# EasyEDA Pro project ProPrj_cheap-board_2026-05-07.epro, board PCB1
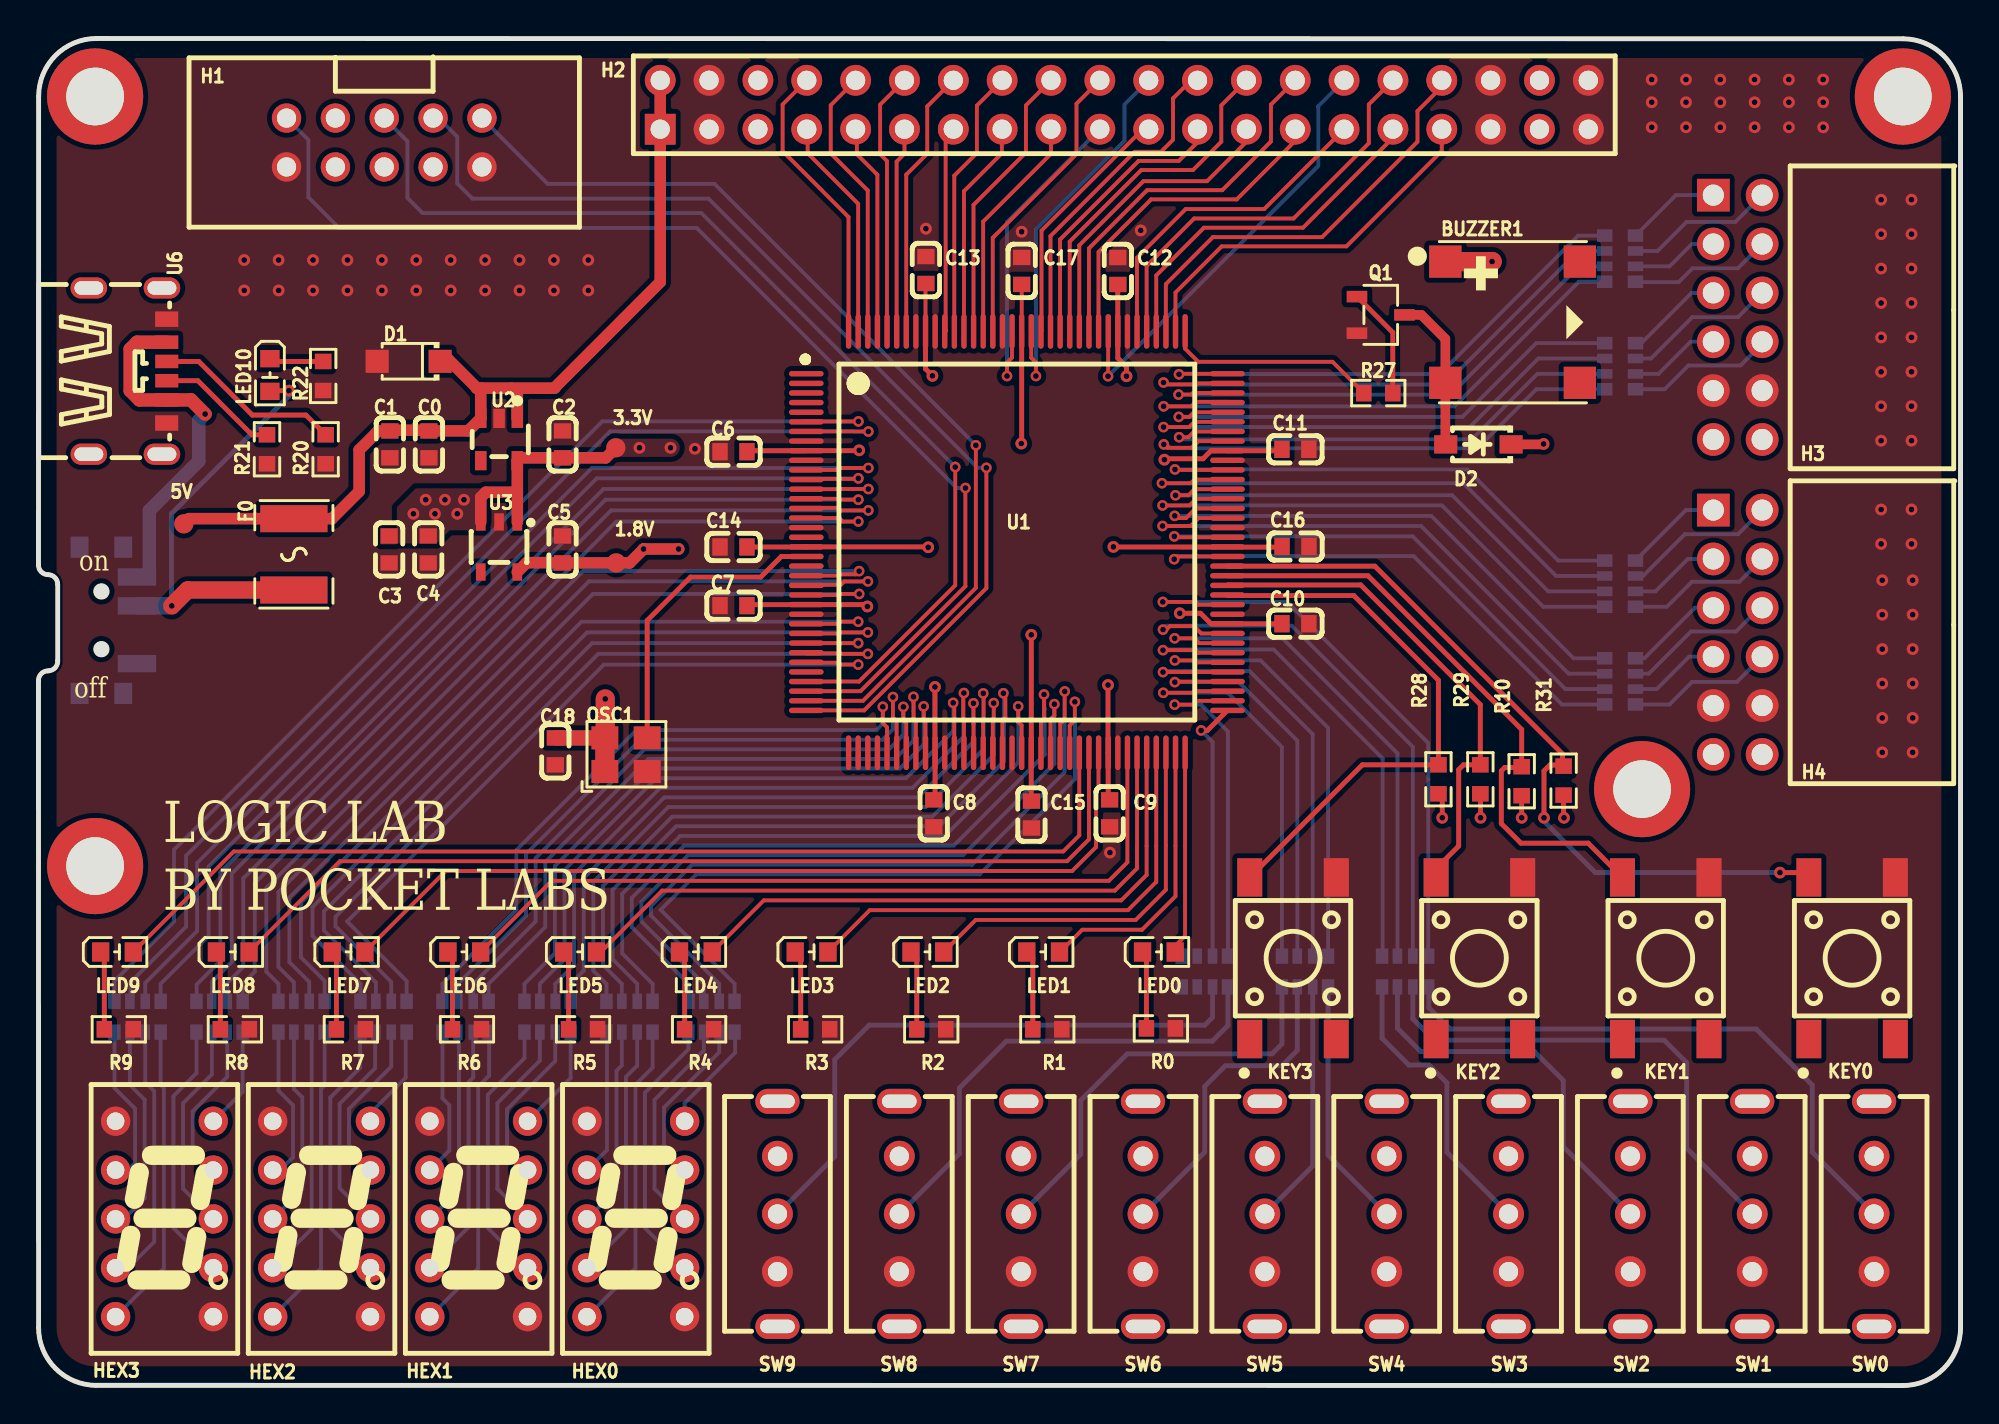
[diagram p1: board, top side]
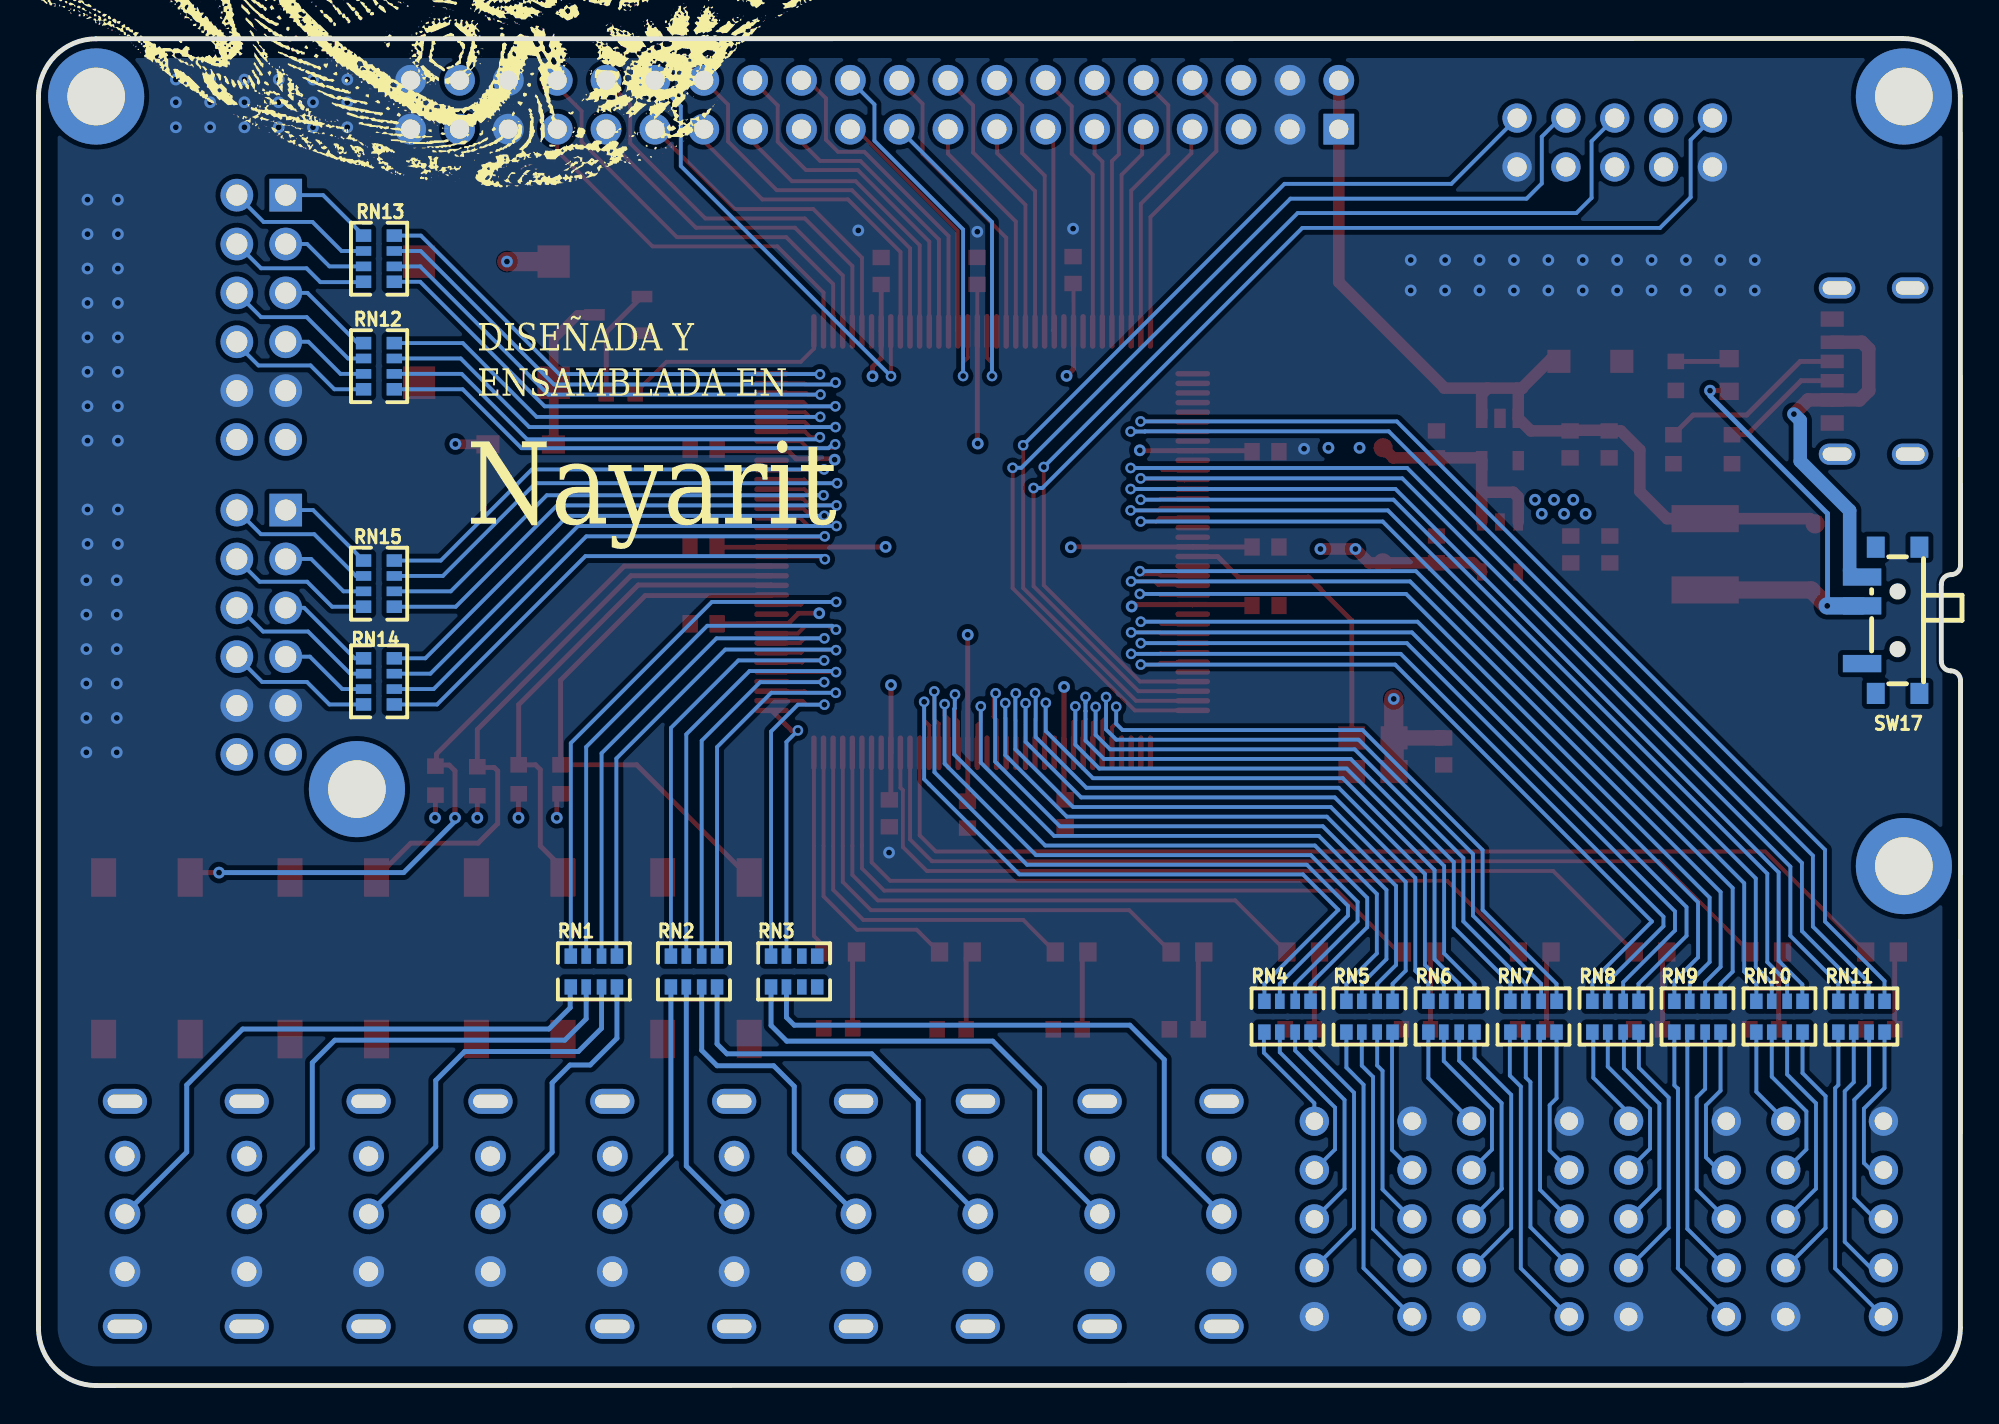
[diagram p2: board, bottom side, seen from below]

Outline 99.95 x 70.02 mm; copper layers: Top Layer, Inner1, Inner2, Bottom Layer. Coordinates in mm from the lower left corner of the outline.
Outline path: 0,36.65 arc(0.15,37) 0.5,37.15 arc(0.85,37.29) 1,37.65 1,41.65 arc(0.85,42) 0.5,42.15 arc(0.15,42.29) 0,42.65 0.01,67.01 arc(0.89,69.14) 3.02,70.02 96.95,70 arc(99.07,69.12) 99.95,67 99.95,3 arc(99.07,0.88) 96.95,0 3.01,0.01 arc(0.88,0.89) 0.01,3.01 0,36.65
Stack: Top Layer 0.035mm Outer layer thickness 1oz / Dielectric1 0.2104mm 7628 RC49% 8.6mil / Inner1 0.0152mm Inner layer thickness / Dielectric2 1.065mm 1.1mm H/HOZ Copper / Inner2 0.0152mm Inner layer thickness / Dielectric3 0.2104mm 7628 RC49% 8.6mil / Bottom Layer 0.035mm Outer layer thickness 1oz

## Design rules (mm)
template: Custom Config
spacing copperThickness1oz (default): track to track 0.102, other pairs 0.152 to 0.3
spacing copperThickness2oz: track to track 0.203, other pairs 0.152 to 0.3
track width copperThickness1oz (default): min 0.127, default 0.254, max 2.54
track width copperThickness2oz: min 0.203, default 0.254, max 2.54
differential pair differentialPair (default): width min 0.127, default 0.254, max 2.54; gap min 0.152, default 0.152
via viaSize (default): diameter min 0.5, default 0.61, max 10; hole min 0.3, default 0.305, max 6.3

## Placement (name value [footprint] x y rotation side)
1.8V  -  [Test-Point-0.5mm]  30.04 42.76 0 top
3.3V  -  [Test-Point-0.5mm]  30.02 48.74 0 top
5V  -  [Test-Point-0.5mm]  7.56 44.79 0 top
BUZZER1  2.7kHz  [BUZ-SMD_4P-L7.5-W7.5-P7.59-TL]  76.65 55.27 0 top
C0  100nF  [C0603]  20.3 48.92 90 top
C1  4.7uF  [C0603]  18.27 48.92 90 top
C2  4.7uF  [C0603]  27.25 48.92 270 top
C3  100nF  [C0603]  18.23 43.46 90 top
C4  4.7uF  [C0603]  20.27 43.46 90 top
C5  4.7uF  [C0603]  27.25 43.46 270 top
C6  100nF  [C0603]  36.14 48.54 0 top
C7  100nF  [C0603]  36.14 40.54 0 top
C8  100nF  [C0603]  46.56 29.74 90 top
C9  100nF  [C0603]  55.7 29.74 90 top
C10  100nF  [C0603]  65.36 39.6 180 top
C11  100nF  [C0603]  65.36 48.66 180 top
C12  100nF  [C0603]  56.13 57.93 270 top
C13  100nF  [C0603]  46.15 57.98 270 top
C14  100nF  [C0603]  36.14 43.58 0 top
C15  100nF  [C0603]  51.63 29.68 90 top
C16  100nF  [C0603]  65.37 43.61 180 top
C17  100nF  [C0603]  51.13 57.94 270 top
C18  100nF  [C0603]  26.88 32.96 90 top
D1  SMF5.0A  [SOD-123FL_L2.7-W1.8-LS3.8-RD]  19.25 53.24 180 top
D2  1N4148W-7-F  [SOD-123_L2.7-W1.6-LS3.7-RD-1]  74.88 48.92 180 top
F0  MF-MSMF050-2  [F1812]  13.28 43.2 270 top
H1  2.54-2*5P简牛  [IDC-TH_10P-P2.54_C5665]  17.98 64.61 180 top
H2  2.54-2*20  [HDR-TH_40P-P2.54-V-F-R2-C20-S2.54]  56.46 66.57 0 top
H3  HX PM2.54-2x6P WC  [HDR-TH_12P-P2.54-H-F-R2-C6-S2.54-W12.7-N]  88.36 55.52 90 top
H4  HX PM2.54-2x6P WC  [HDR-TH_12P-P2.54-H-F-R2-C6-S2.54-W12.7-N]  88.36 39.15 90 top
HEX0  FJ3161AH  [LED-SEG-TH_10P-L14.0-W7.5-P2.54-S5.08-TL]  31.06 8.66 0 top
HEX1  FJ3161AH  [LED-SEG-TH_10P-L14.0-W7.5-P2.54-S5.08-TL]  22.89 8.66 0 top
HEX2  FJ3161AH  [LED-SEG-TH_10P-L14.0-W7.5-P2.54-S5.08-TL]  14.72 8.66 0 top
HEX3  FJ3161AH  [LED-SEG-TH_10P-L14.0-W7.5-P2.54-S5.08-TL]  6.55 8.66 0 top
KEY0  KH-6X6X6H-STM  [SW-SMD_4P-L6.0-W6.0-P4.50-LS9.0_KH-6X6X6H-STM]  94.31 22.21 90 top
KEY1  KH-6X6X6H-STM  [SW-SMD_4P-L6.0-W6.0-P4.50-LS9.0_KH-6X6X6H-STM]  84.62 22.21 90 top
KEY2  KH-6X6X6H-STM  [SW-SMD_4P-L6.0-W6.0-P4.50-LS9.0_KH-6X6X6H-STM]  74.93 22.21 90 top
KEY3  KH-6X6X6H-STM  [SW-SMD_4P-L6.0-W6.0-P4.50-LS9.0_KH-6X6X6H-STM]  65.24 22.21 90 top
LED0  YLED0603R  [LED0603-FD]  58.26 22.53 180 top
LED1  YLED0603R  [LED0603-FD]  52.24 22.53 180 top
LED2  YLED0603R  [LED0603-FD]  46.22 22.53 180 top
LED3  YLED0603R  [LED0603-FD]  40.2 22.53 180 top
LED4  YLED0603R  [LED0603-FD]  34.18 22.53 180 top
LED5  YLED0603R  [LED0603-FD]  28.16 22.53 180 top
LED6  YLED0603R  [LED0603-FD]  22.14 22.53 180 top
LED7  YLED0603R  [LED0603-FD]  16.12 22.53 180 top
LED8  YLED0603R  [LED0603-FD]  10.1 22.53 180 top
LED9  YLED0603R  [LED0603-FD]  4.08 22.53 180 top
LED10  YLED0603R  [LED0603-FD]  12.03 52.52 90 top
NOREF  -  [Pad_e107]  96.95 67 0 top
NOREF#2  -  [Pad_e109]  2.95 27 0 top
NOREF#3  -  [Pad_e110]  83.39 31 0 top
NOREF#4  -  [Pad_e106]  2.95 67 0 top
OSC1  50MHz  [OSC-SMD_4P-L3.2-W2.5-BL]  30.55 32.79 0 top
Q1  MMBT3904LT1G  [SOT-23-3_L2.9-W1.6-P1.90-LS2.8-BR]  69.8 55.65 180 top
R0  1kΩ  [R0603]  58.37 18.56 180 top
R1  1kΩ  [R0603]  52.46 18.52 180 top
R2  1kΩ  [R0603]  46.42 18.52 180 top
R3  1kΩ  [R0603]  40.39 18.52 180 top
R4  1kΩ  [R0603]  34.35 18.52 180 top
R5  1kΩ  [R0603]  28.32 18.52 180 top
R6  1kΩ  [R0603]  22.28 18.52 180 top
R7  1kΩ  [R0603]  16.25 18.52 180 top
R8  1kΩ  [R0603]  10.21 18.52 180 top
R9  1kΩ  [R0603]  4.18 18.52 180 top
R10  0kΩ  [R0603]  77.13 31.41 270 top
R20  5.1kΩ  [R0603]  14.93 48.66 90 top
R21  5.1kΩ  [R0603]  11.88 48.66 90 top
R22  10kΩ  [R0603]  14.8 52.47 90 top
R27  1kΩ  [R0603]  69.67 51.58 180 top
R28  0kΩ  [R0603]  72.8 31.51 270 top
R29  0kΩ  [R0603]  74.98 31.51 270 top
R31  0kΩ  [R0603]  79.31 31.44 270 top
RN1  10kΩ  [RES-ARRAY-SMD_0603-8P-L3.2-W1.6-BL]  71.07 21.52 180 bottom
RN2  10kΩ  [RES-ARRAY-SMD_0603-8P-L3.2-W1.6-BL]  65.86 21.52 180 bottom
RN3  10kΩ  [RES-ARRAY-SMD_0603-8P-L3.2-W1.6-BL]  60.65 21.52 180 bottom
RN4  1kΩ  [RES-ARRAY-SMD_0603-8P-L3.2-W1.6-BL]  35 19.17 180 bottom
RN5  1kΩ  [RES-ARRAY-SMD_0603-8P-L3.2-W1.6-BL]  30.73 19.17 180 bottom
RN6  1kΩ  [RES-ARRAY-SMD_0603-8P-L3.2-W1.6-BL]  26.47 19.17 180 bottom
RN7  1kΩ  [RES-ARRAY-SMD_0603-8P-L3.2-W1.6-BL]  22.21 19.17 180 bottom
RN8  1kΩ  [RES-ARRAY-SMD_0603-8P-L3.2-W1.6-BL]  17.94 19.17 180 bottom
RN9  1kΩ  [RES-ARRAY-SMD_0603-8P-L3.2-W1.6-BL]  13.68 19.17 180 bottom
RN10  1kΩ  [RES-ARRAY-SMD_0603-8P-L3.2-W1.6-BL]  9.42 19.17 180 bottom
RN11  1kΩ  [RES-ARRAY-SMD_0603-8P-L3.2-W1.6-BL]  5.15 19.17 180 bottom
RN12  100Ω  [RES-ARRAY-SMD_0603-8P-L3.2-W1.6-BL]  82.24 52.98 270 bottom
RN13  100Ω  [RES-ARRAY-SMD_0603-8P-L3.2-W1.6-BL]  82.24 58.57 270 bottom
RN14  100Ω  [RES-ARRAY-SMD_0603-8P-L3.2-W1.6-BL]  82.24 36.6 270 bottom
RN15  100Ω  [RES-ARRAY-SMD_0603-8P-L3.2-W1.6-BL]  82.24 41.68 270 bottom
SW0  SS12F44G4  [SW-TH_SHOU-HAN_SS12F44G4]  95.45 8.92 90 top
SW1  SS12F44G4  [SW-TH_SHOU-HAN_SS12F44G4]  89.11 8.92 90 top
SW2  SS12F44G4  [SW-TH_SHOU-HAN_SS12F44G4]  82.78 8.92 90 top
SW3  SS12F44G4  [SW-TH_SHOU-HAN_SS12F44G4]  76.44 8.92 90 top
SW4  SS12F44G4  [SW-TH_SHOU-HAN_SS12F44G4]  70.11 8.92 90 top
SW5  SS12F44G4  [SW-TH_SHOU-HAN_SS12F44G4]  63.77 8.92 90 top
SW6  SS12F44G4  [SW-TH_SHOU-HAN_SS12F44G4]  57.43 8.92 90 top
SW7  SS12F44G4  [SW-TH_SHOU-HAN_SS12F44G4]  51.1 8.92 90 top
SW8  SS12F44G4  [SW-TH_SHOU-HAN_SS12F44G4]  44.76 8.92 90 top
SW9  SS12F44G4  [SW-TH_SHOU-HAN_SS12F44G4]  38.43 8.92 90 top
SW17  MK-12C02-G020  [SW-SMD_MK-12C02-G020]  3.63 39.77 90 bottom
U1  5M240ZT144C5N  [TQFP-144_L20.0-W20.0-P0.50-LS22.0-BL]  50.88 43.84 270 top
U2  AP2112K-3.3TRG1  [SOT-23-5_L2.9-W1.6-P0.95-LS2.8-BR]  23.95 49.17 90 top
U3  AP2112K-1.8TRG1  [SOT-25_L3.0-W1.6-P0.95-LS2.8-BL]  23.95 43.58 180 top
U6  USB-TYPE-C-009  [TYPE-C-SMD_TYPE-C-6P]  4.64 52.73 270 top

## Footprints (pads in the part's own frame, mm; a bottom-side part is the same pattern mirrored in y, then rotated)
BUZ-SMD_4P-L7.5-W7.5-P7.59-TL
  rect 1.681x1.68 smd: 1(-3.498,3.15) 2(-3.498,-3.15) 3(3.498,-3.15) 4(3.498,3.15)
C0603
  rect 0.8x0.9 smd: 1(-0.7,0) 2(0.7,0)
F1812
  rect 1.407x3.499 smd: 1(-1.853,0) 2(1.853,0)
HDR-TH_12P-P2.54-H-F-R2-C6-S2.54-W12.7-N
  rect 1.7x1.7 hole 1.1: 1(6.35,1.27)
  round 1.7 hole 1.1: 2(6.35,-1.27) 3(3.81,1.27) 4(3.81,-1.27) 5(1.27,1.27) 6(1.27,-1.27) 7(-1.27,1.27) 8(-1.27,-1.27) 9(-3.81,1.27) 10(-3.81,-1.27) 11(-6.35,1.27) 12(-6.35,-1.27)
HDR-TH_40P-P2.54-V-F-R2-C20-S2.54
  rect 1.6x1.6 hole 1: 1(-24.13,-1.27)
  round 1.6 hole 1: 2(-24.13,1.27) 3(-21.59,-1.27) 4(-21.59,1.27) 5(-19.05,-1.27) 6(-19.05,1.27) 7(-16.51,-1.27) 8(-16.51,1.27) 9(-13.97,-1.27) 10(-13.97,1.27) 11(-11.43,-1.27) 12(-11.43,1.27) 13(-8.89,-1.27) 14(-8.89,1.27) 15(-6.35,-1.27) 16(-6.35,1.27) 17(-3.81,-1.27) 18(-3.81,1.27) 19(-1.27,-1.27) 20(-1.27,1.27) 21(1.27,-1.27) 22(1.27,1.27) 23(3.81,-1.27) 24(3.81,1.27) 25(6.35,-1.27) 26(6.35,1.27) 27(8.89,-1.27) 28(8.89,1.27) 29(11.43,-1.27) 30(11.43,1.27) 31(13.97,-1.27) 32(13.97,1.27) 33(16.51,-1.27) 34(16.51,1.27) 35(19.05,-1.27) 36(19.05,1.27) 37(21.59,-1.27) 38(21.59,1.27) 39(24.13,-1.27) 40(24.13,1.27)
IDC-TH_10P-P2.54_C5665
  round 1.524 hole 1: 1(-5.08,-1.27) 2(-5.08,1.27) 3(-2.54,-1.27) 4(-2.54,1.27) 5(0,-1.27) 6(0,1.27) 7(2.54,-1.27) 8(2.54,1.27) 9(5.08,-1.27) 10(5.08,1.27)
LED0603-FD
  rect 0.9x1 smd: 1(-0.85,0) 2(0.85,0)
LED-SEG-TH_10P-L14.0-W7.5-P2.54-S5.08-TL
  round 1.524 hole 0.914: 1(-2.54,5.08) 2(-2.54,2.54) 3(-2.54,0) 4(-2.54,-2.54) 5(-2.54,-5.08) 6(2.54,-5.08) 7(2.54,-2.54) 8(2.54,0) 9(2.54,2.54) 10(2.54,5.08)
OSC-SMD_4P-L3.2-W2.5-BL
  rect 1.4x1.2 smd: 1(-1.1,-0.875) 2(1.1,-0.875) 3(1.1,0.875) 4(-1.1,0.875)
Pad_e106
  round 5 hole 3: 1(0,0)
Pad_e107
  round 5 hole 3: 1(0,0)
Pad_e109
  round 5 hole 3: 1(0,0)
Pad_e110
  round 5 hole 3: 1(0,0)
R0603
  rect 0.806x0.864 smd: 1(-0.753,0) 2(0.753,0)
RES-ARRAY-SMD_0603-8P-L3.2-W1.6-BL
  rect 0.65x0.8 smd: 1(-1.2,-0.8) 4(1.2,-0.8) 5(1.2,0.8) 8(-1.2,0.8)
  rect 0.5x0.8 smd: 2(-0.4,-0.8) 3(0.4,-0.8) 6(0.4,0.8) 7(-0.4,0.8)
SOD-123_L2.7-W1.6-LS3.7-RD-1
  rect 1.2x0.95 smd: 1(-1.7,0) 2(1.7,0)
SOD-123FL_L2.7-W1.8-LS3.8-RD
  rect 1.2x1.2 smd: 1(-1.635,0) 2(1.635,0)
SOT-23-3_L2.9-W1.6-P1.90-LS2.8-BR
  rect 1.07x0.6 smd: 1(1.235,-0.95) 2(1.235,0.95) 3(-1.235,0)
SOT-23-5_L2.9-W1.6-P0.95-LS2.8-BR
  rect 1x0.6 smd: 1(1.1,-0.95) 2(1.1,0) 3(1.1,0.95) 4(-1.1,0.95) 5(-1.1,-0.95)
SOT-25_L3.0-W1.6-P0.95-LS2.8-BL
  rect 0.5x0.9 smd: 1(-0.95,-1.3) 2(0,-1.3) 3(0.95,-1.3) 4(0.95,1.3) 5(-0.95,1.3)
SW-SMD_4P-L6.0-W6.0-P4.50-LS9.0_KH-6X6X6H-STM
  rect 2x1.3 smd: 1(-4.2,2.25) 2(4.2,2.25) 3(-4.2,-2.25) 4(4.2,-2.25)
SW-SMD_MK-12C02-G020
  rect 0.9x2 smd: 1(-2.25,1.49) 2(0.75,1.49) 3(2.25,1.49)
  rect 1.1x0.93 smd: 4(3.8,0.779) 5(3.8,-1.49) 6(-3.8,-1.49) 7(-3.8,0.779)
SW-TH_SHOU-HAN_SS12F44G4
  round 1.6 hole 1: 1(-3,0) 2(0,0) 3(3,0)
  oval 1.3x2.3 hole 0.7x1.8: 4(5.85,0) 5(-5.85,0)
Test-Point-0.5mm
  round 1 smd: 1(0,0)
TQFP-144_L20.0-W20.0-P0.50-LS22.0-BL
  oval 0.28x1.8 smd: 1(-8.75,-10.95) 2(-8.25,-10.95) 3(-7.75,-10.95) 4(-7.25,-10.95) 5(-6.75,-10.95) 6(-6.25,-10.95) 7(-5.75,-10.95) 8(-5.25,-10.95) 9(-4.75,-10.95) 10(-4.25,-10.95) 11(-3.75,-10.95) 12(-3.25,-10.95) 13(-2.75,-10.95) 14(-2.25,-10.95) 15(-1.75,-10.95) 16(-1.25,-10.95) 17(-0.75,-10.95) 18(-0.25,-10.95) 19(0.25,-10.95) 20(0.75,-10.95) 21(1.25,-10.95) 22(1.75,-10.95) 23(2.25,-10.95) 24(2.75,-10.95) 25(3.25,-10.95) 26(3.75,-10.95) 27(4.25,-10.95) 28(4.75,-10.95) 29(5.25,-10.95) 30(5.75,-10.95) 31(6.25,-10.95) 32(6.75,-10.95) 33(7.25,-10.95) 34(7.75,-10.95) 35(8.25,-10.95) 36(8.75,-10.95) 73(8.75,10.95) 74(8.25,10.95) 75(7.75,10.95) 76(7.25,10.95) 77(6.75,10.95) 78(6.25,10.95) 79(5.75,10.95) 80(5.25,10.95) 81(4.75,10.95) 82(4.25,10.95) 83(3.75,10.95) 84(3.25,10.95) 85(2.75,10.95) 86(2.25,10.95) 87(1.75,10.95) 88(1.25,10.95) 89(0.75,10.95) 90(0.25,10.95) 91(-0.25,10.95) 92(-0.75,10.95) 93(-1.25,10.95) 94(-1.75,10.95) 95(-2.25,10.95) 96(-2.75,10.95) 97(-3.25,10.95) 98(-3.75,10.95) 99(-4.25,10.95) 100(-4.75,10.95) 101(-5.25,10.95) 102(-5.75,10.95) 103(-6.25,10.95) 104(-6.75,10.95) 105(-7.25,10.95) 106(-7.75,10.95) 107(-8.25,10.95) 108(-8.75,10.95)
  oval 1.8x0.28 smd: 37(10.95,-8.75) 38(10.95,-8.25) 39(10.95,-7.75) 40(10.95,-7.25) 41(10.95,-6.75) 42(10.95,-6.25) 43(10.95,-5.75) 44(10.95,-5.25) 45(10.95,-4.75) 46(10.95,-4.25) 47(10.95,-3.75) 48(10.95,-3.25) 49(10.95,-2.75) 50(10.95,-2.25) 51(10.95,-1.75) 52(10.95,-1.25) 53(10.95,-0.75) 54(10.95,-0.25) 55(10.95,0.25) 56(10.95,0.75) 57(10.95,1.25) 58(10.95,1.75) 59(10.95,2.25) 60(10.95,2.75) 61(10.95,3.25) 62(10.95,3.75) 63(10.95,4.25) 64(10.95,4.75) 65(10.95,5.25) 66(10.95,5.75) 67(10.95,6.25) 68(10.95,6.75) 69(10.95,7.25) 70(10.95,7.75) 71(10.95,8.25) 72(10.95,8.75) 109(-10.95,8.75) 110(-10.95,8.25) 111(-10.95,7.75) 112(-10.95,7.25) 113(-10.95,6.75) 114(-10.95,6.25) 115(-10.95,5.75) 116(-10.95,5.25) 117(-10.95,4.75) 118(-10.95,4.25) 119(-10.95,3.75) 120(-10.95,3.25) 121(-10.95,2.75) 122(-10.95,2.25) 123(-10.95,1.75) 124(-10.95,1.25) 125(-10.95,0.75) 126(-10.95,0.25) 127(-10.95,-0.25) 128(-10.95,-0.75) 129(-10.95,-1.25) 130(-10.95,-1.75) 131(-10.95,-2.25) 132(-10.95,-2.75) 133(-10.95,-3.25) 134(-10.95,-3.75) 135(-10.95,-4.25) 136(-10.95,-4.75) 137(-10.95,-5.25) 138(-10.95,-5.75) 139(-10.95,-6.25) 140(-10.95,-6.75) 141(-10.95,-7.25) 142(-10.95,-7.75) 143(-10.95,-8.25) 144(-10.95,-8.75)
TYPE-C-SMD_TYPE-C-6P
  oval 1.1x1.9 hole 0.7x1.5: 7(-4.32,1.775) 7(-4.32,-2.025) 7(4.32,1.775) 7(4.32,-2.025)
  rect 0.7x1.2 smd: A5(-0.5,2.025) A9(1.5,2.025) B5(0.5,2.025) B9(-1.5,2.025)
  rect 0.8x1.2 smd: A12(2.7,2.025) B12(-2.7,2.025)

## Nets
As in the schematic.

Pads without a net: BUZZER1 3 4; H1 6 7 8; KEY0 1 3; KEY1 1 3; KEY2 1 3; KEY3 1 3; NOREF 1; NOREF#2 1; NOREF#3 1; NOREF#4 1; RN3 3 4 5 6; SW0 4 5; SW1 4 5; SW2 4 5; SW3 4 5; SW4 4 5; SW5 4 5; SW6 4 5; SW7 4 5; SW8 4 5; SW9 4 5; SW17 1 4 5 6 7; U1 1 2 3 4 5 18 21 32 37 38 39 40; U2 4; U3 4; U6 7

## Via types
v1: diameter 0.61, hole 0.305, Top Layer to Bottom Layer, 111 vias
v2: diameter 0.55, hole 0.305, Top Layer to Bottom Layer, 65 vias

## Routing (per net, layer and track width the routed paths; a pad name or vN(x,y) marks a point on that pad's centre or on a via; arc(x,y) is an arc through that point)
1.8V: length 44.1
  Top Layer w0.2: 51.13,54.79 C17.2
  Top Layer w0.254: v1(46.27,43.57) 46.25,43.59 U1.19 ; v1(51.11,48.96) 51.13,48.98 U1.126 51.12,54.79 ; 51.62,32.89 51.62,30.39 C15.2 ; v1(55.9,43.59) 55.98,43.59 55.98,43.58 64.64,43.58 64.67,43.55 64.67,43.49 ; 36.84,43.58 39.92,43.58 39.92,43.59 ; 51.63,32.94 v1(51.63,39.02)
  Top Layer w0.6: U3.5 25.38,42.77 27.24,42.77 C5.2 30.04,42.76 ; 1.8V.1 30.74,42.76 v1(31.47,43.48) v1(33.29,43.48)
3.3V: length 73.3
  Top Layer w0.2: 46.05,57.23 46.12,57.16 U1.136
  Top Layer w0.254: R29.2 74.99,30.75 74.99,29.49 ; 46.63,32.94 46.62,32.95 v1(46.62,36.31) ; v1(43.1,40.49) 43,40.59 U1.25 ; v1(59.35,40.14) 60.42,40.14 60.97,39.59 U1.82 64.65,39.59 64.66,39.6 ; 55.62,32.89 55.62,30.45 55.7,30.38 ; 36.84,48.54 36.89,48.59 39.92,48.59 ; 46.62,32.89 46.62,30.44 46.68,30.38 ; U1.64 55.62,32.9 v1(55.62,36.41) ; R10.2 77.13,29.49 ; R31.2 79.31,29.58 79.33,29.56 ; U1.136 46.13,52.84 v1(46.49,52.48) ; v1(58.55,48.12) 58.59,48.17 60.55,48.17 60.97,48.59 U1.100 ; 64.68,48.47 64.57,48.59 61.83,48.59 ; v1(42.68,48.61) 42.66,48.59 U1.9 ; R28.2 73,30.56 73,29.46 ; v1(56.58,52.46) 56.58,52.95 56.13,53.4 U1.116 56.12,57.19 56.08,57.23 ; 36.84,40.66 36.92,40.59 39.92,40.59
  Top Layer w0.5: v1(78.27,48.94) 78.24,48.92 D2.1
  Top Layer w0.6: 3.3V.1 29.5,48.22 C2.2 25.05,48.22 U2.5 24.9,46.43 ; U3.3 23,46.17 23.26,46.43 24.9,46.43 ; 24.9,46.43 24.9,46.44 ; 24.9,46.43 U3.1
  Top Layer w0.8: 26.92,33.66 29.36,33.66 29.41,33.62
  Top Layer w1: OSC1.1 OSC1.4 29.41,33.62 ; v1(75.59,58.42) 75.58,58.42 BUZZER1.1 ; 29.47,33.68 v1(29.47,35.69)
  vias: v1(19.5,45.31) v1(20.14,46.04) v1(20.62,45.31) v1(21.14,46.04) v1(21.78,45.31) v1(22.13,46.04) v1(31.25,48.74) v1(32.87,48.74) v1(73,29.51) v1(74.99,29.51) v1(77.13,29.51) v1(79.33,29.51)
5VF: length 47.4
  Top Layer w0.6: 22.81,51.84 21.31,53.34 20.99,53.34 D1.1 ; 22.81,51.84 22.77,51.84 ; 22.81,51.84 22.87,51.77 23,51.77 ; 22.81,51.84 23.07,51.84 ; 26.86,51.88 32.33,57.36 H2.1 H2.2 ; 23,51.77 U2.3 22.34,49.62 C0.2 20.27,49.65 18.31,49.65 C1.2 17.66,49.62 16.68,48.63 16.68,46.47 15.26,45.06 F0.1 7.83,45.06 5V.1 ; 23,51.77 23.07,51.84 ; 23.07,51.84 24.58,51.84 ; 26.86,51.84 24.58,51.84 ; 24.58,51.84 24.9,51.52 U2.1
+5V: length 23.2
  Top Layer w0.254: v1(13.03,51.71) 12.07,51.71 LED10.1
  Top Layer w0.9: v1(6.93,40.52) 7.76,41.35 F0.2
  Bottom Layer w0.254: v1(6.93,40.52) 6.92,40.54 6.92,45.32 13.03,51.43 v1(13.03,51.71)
  Bottom Layer w0.9: SW17.2 v1(6.93,40.52)
GND:
  vias: v1(10.7,58.5) v1(10.7,56.92) v1(12.49,58.5) v1(12.49,56.92) v1(14.28,58.5) v1(14.28,56.92) v1(16.07,58.5) v1(16.07,56.92) v1(17.86,58.5) v1(17.86,56.92) v1(19.64,58.5) v1(19.65,56.92) v1(21.43,58.5) v1(21.44,56.92) v1(23.22,58.5) v1(23.22,56.92) v1(25.01,58.5) v1(25.01,56.92) v1(26.8,58.5) v1(26.8,56.92) v1(28.59,58.5) v1(28.59,56.92) v1(34.14,48.69) v1(46.15,60.13) v1(51.13,59.97) v1(55.72,27.7) v1(57.32,60.04) v1(83.89,67.88) v1(83.89,66.7) v1(83.89,65.4) v1(85.67,67.88) v1(85.67,66.7) v1(85.67,65.4) v1(87.45,67.88) v1(87.45,66.7) v1(87.45,65.4) v1(89.23,67.88) v1(89.24,66.7) v1(89.24,65.4) v1(91.02,67.88) v1(91.02,66.7) v1(91.02,65.4) v1(92.8,67.88) v1(92.8,66.7) v1(92.8,65.4) v1(95.82,61.64) v1(95.82,59.85) v1(95.82,58.06) v1(95.82,56.27) v1(95.82,54.48) v1(95.82,52.69) v1(95.82,50.9) v1(95.82,49.11) v1(95.82,45.53) v1(95.82,43.74) v1(95.88,41.86) v1(95.88,40.07) v1(95.88,38.28) v1(95.88,36.49) v1(95.88,34.7) v1(95.88,32.91) v1(97.4,61.64) v1(97.4,59.85) v1(97.4,58.06) v1(97.4,56.27) v1(97.4,54.48) v1(97.4,52.69) v1(97.4,50.9) v1(97.4,49.11) v1(97.4,45.53) v1(97.4,43.74) v1(97.46,41.86) v1(97.46,40.07) v1(97.46,38.28) v1(97.46,36.49) v1(97.46,34.7) v1(97.46,32.91)
VCC: length 18.7
  Top Layer w0.7: U6.B9 5.13,54.23 4.77,53.87 4.77,51.71 5.26,51.23 U6.A9 7.93,51.23 v1(8.66,50.49)
  Bottom Layer w0.7: SW17.3 5.44,42.02 5.77,42.35 5.77,45.48 8.33,48.05 8.33,50.16 v1(8.66,50.49)
CLK: length 15.7
  Top Layer w0.254: OSC1.3 31.65,39.77 33.91,42.02 37.56,42.02 38.62,43.09 39.92,43.09
HEX_0_A: length 37.5
  Top Layer w0.2: v2(53.89,35.54) 53.89,34.58 53.62,34.31 53.62,32.89
  Bottom Layer w0.2: 53.62,31.25 48.94,26.57 34.2,26.57 32.35,24.72 36.2,20.88 RN4.8
  Bottom Layer w0.201: 53.62,31.25 53.89,31.52 v2(53.89,35.54)
HEX_0_B: length 38.3
  Top Layer w0.201: v2(53.36,36.08) 53.36,34.63 53.13,34.4 53.13,32.9 53.12,32.89
  Bottom Layer w0.2: RN4.7 35.4,20.88 31.85,24.42 31.85,24.93 33.99,27.07 48.54,27.07
  Bottom Layer w0.201: v2(53.36,36.08) 53.36,35.89 53.35,35.88 53.36,31.88 48.54,27.07
HEX_0_C: length 36.7
  Top Layer w0.201: 52.62,32.89 52.63,32.89 52.63,34.63 52.83,34.83 v2(52.83,35.42)
  Bottom Layer w0.2: RN4.6 34.6,20.88 31.35,24.12 31.35,25.14 33.78,27.57 48.07,27.57
  Bottom Layer w0.201: 48.07,27.57 52.83,32.32 v2(52.83,35.42)
HEX_0_D: length 35.1
  Top Layer w0.2: v2(50.95,35.3) 50.95,34.49 51.12,34.32 51.12,32.89
  Bottom Layer w0.2: RN5.8 31.93,20.88 30.35,22.46 30.35,25.55 33.37,28.57 47.13,28.57
  Bottom Layer w0.201: v2(50.95,35.3) 50.95,32.38 47.13,28.57
HEX_0_DP: length 37.4
  Top Layer w0.201: v2(52.29,35.92) 52.29,34.65 52.13,34.49 52.13,32.89 52.12,32.89
  Bottom Layer w0.2: RN4.5 33.8,20.88 30.85,23.82 30.85,25.35 33.57,28.07 47.59,28.07
  Bottom Layer w0.201: 47.59,28.07 52.33,32.8 52.33,35.17 52.3,35.2 52.3,35.64 52.29,35.65 v2(52.29,35.92)
HEX_0_E: length 36.2
  Top Layer w0.201: v2(50.18,35.98) 50.23,35.98 50.28,35.94 50.28,34.75 50.12,34.6 50.12,32.89
  Bottom Layer w0.2: 50.12,32.36 46.83,29.07 33.16,29.07 29.85,25.76 29.85,22.16 31.13,20.88 RN5.7
  Bottom Layer w0.201: 50.12,32.36 50.2,32.43 50.2,35.96 v2(50.18,35.98)
HEX_0_F: length 35.7
  Top Layer w0.201: 49.12,32.89 49.12,34.56 49.15,34.58 49.15,35.96 v2(49.13,35.98)
  Bottom Layer w0.2: 48.95,32.87 46.14,30.07 32.75,30.07 28.85,26.17 28.85,21.56 29.53,20.88 RN5.5
  Bottom Layer w0.201: 48.95,32.87 49.15,33.07 49.15,35.96 v2(49.13,35.98)
HEX_0_G: length 34.8
  Top Layer w0.201: v2(49.67,35.47) 49.67,34.7 49.62,34.65 49.62,32.89
  Bottom Layer w0.2: 49.54,32.63 46.47,29.57 32.95,29.57 29.35,25.97 29.35,21.86 30.33,20.88 RN5.6
  Bottom Layer w0.201: 49.54,32.63 49.67,32.77 v2(49.67,35.47)
HEX_1_A: length 34.5
  Top Layer w0.201: 48.62,32.89 48.62,34.37 48.62,34.38 v2(48.62,35.46)
  Bottom Layer w0.2: 48.36,33.2 45.72,30.57 32.54,30.57 28.35,26.38 28.35,21.56 27.67,20.88 27.67,19.97
  Bottom Layer w0.201: 48.36,33.2 48.62,33.46 v2(48.62,35.46)
HEX_1_B: length 35.6
  Top Layer w0.2: v2(48.12,35.99) 48.09,35.96 48.09,34.64 48.12,34.61 48.12,32.89
  Bottom Layer w0.2: 45.45,31.07 32.33,31.07 27.85,26.59 27.85,21.86 26.87,20.88 26.87,19.97
  Bottom Layer w0.201: 45.45,31.07 48.09,33.7 48.09,35.96 v2(48.12,35.99)
HEX_1_C: length 34.6
  Top Layer w0.201: 47.62,32.89 47.62,35.42 v2(47.56,35.48)
  Bottom Layer w0.2: RN6.6 26.07,20.88 27.35,22.16 27.35,26.8 32.12,31.57 45.11,31.57
  Bottom Layer w0.201: 45.11,31.57 47.56,34.02 v2(47.56,35.48)
HEX_1_D: length 35.5
  Top Layer w0.201: 45.62,32.89 45.62,34.49 45.5,34.61 45.5,35.62 45.5,35.63 v2(45.5,35.8)
  Bottom Layer w0.2: 23.41,19.97 23.41,20.88 26.35,23.82 26.35,27.21 31.71,32.57 44.54,32.57
  Bottom Layer w0.201: v2(45.5,35.8) 45.5,35.5 45.5,35.49 45.5,35.06 45.5,35.05 45.5,33.52 44.54,32.57
HEX_1_DP: length 33.9
  Top Layer w0.201: v2(46.03,35.3) 46.03,34.58 46.12,34.48 46.12,32.89
  Bottom Layer w0.2: 44.78,32.07 31.92,32.07 26.85,27 26.85,22.46 25.27,20.88 RN6.5
  Bottom Layer w0.201: v2(46.03,35.3) 46.03,33.31 44.78,32.07
HEX_1_E: length 34.5
  Top Layer w0.201: 45.12,32.89 45.12,34.43 44.97,34.58 v2(44.97,35.28)
  Bottom Layer w0.2: RN7.7 22.61,20.88 25.85,24.12 25.85,27.42 31.5,33.07 44.22,33.07 44.95,33.8
  Bottom Layer w0.201: 44.95,33.8 44.97,33.82 v2(44.97,35.28)
HEX_1_F: length 34.6
  Top Layer w0.201: v2(43.91,35.28) 43.91,34.44 44.12,34.22 44.12,32.89
  Bottom Layer w0.2: RN7.5 21.01,20.88 24.85,24.72 24.85,27.83 31.09,34.07 43.57,34.07
  Bottom Layer w0.201: 43.57,34.07 43.91,34.4 v2(43.91,35.28)
HEX_1_G: length 35.5
  Top Layer w0.201: v2(44.43,35.78) 44.43,34.72 44.62,34.53 44.62,32.89
  Bottom Layer w0.2: 43.9,33.57 31.3,33.57 25.35,27.62 25.35,24.42 21.81,20.88 21.81,19.97
  Bottom Layer w0.201: v2(44.43,35.78) 44.43,34.1 43.9,33.57
HEX_2_A: length 40.3
  Top Layer w0.2: 39.92,37.59 39.94,37.57 41.6,37.57 41.69,37.47 42.63,37.47
  Bottom Layer w0.2: 42.63,37.47 29.4,37.47 16.05,24.12 19.14,21.03 RN8.8
  vias: v2(42.63,37.47)
HEX_2_B: length 42.2
  Top Layer w0.201: 43.13,38.03 41.64,38.03 41.61,38.06 39.95,38.06 39.92,38.09 ; 43.13,38.03 43.13,38.09
  Bottom Layer w0.2: RN8.7 18.34,20.98 15.45,23.87 15.45,24.37 29.11,38.03 43.13,38.03
  vias: v2(43.13,38.03)
HEX_2_C: length 42
  Top Layer w0.201: 39.92,38.59 42.62,38.59
  Bottom Layer w0.2: RN8.6 17.54,20.96 14.85,23.65 14.85,24.65 28.79,38.59 42.62,38.59
  vias: v2(42.63,38.59)
HEX_2_D: length 43.4
  Top Layer w0.201: 39.92,39.59 41.54,39.59 41.66,39.7 42.62,39.7
  Bottom Layer w0.2: 42.62,39.7 28.24,39.7 13.65,25.11 13.65,22.26 14.88,21.03 RN9.8
  vias: v2(42.63,39.7)
HEX_2_DP: length 44
  Top Layer w0.201: v2(43.13,39.14) 41.64,39.14 41.58,39.09 39.92,39.09
  Bottom Layer w0.2: v2(43.13,39.14) 28.53,39.14 14.25,24.87 14.25,23.37 16.74,20.88 RN8.5
HEX_2_E: length 44.8
  Top Layer w0.201: v2(42.68,41.14) 41.66,41.14 41.61,41.09 39.92,41.09
  Bottom Layer w0.2: v2(42.68,41.14) 28.83,41.14 13.05,25.36 13.05,22.01 14.08,20.98 RN9.7
HEX_2_F: length 46.6
  Top Layer w0.201: v2(42.67,42.33) 42.51,42.16 41.65,42.16 41.58,42.1 39.93,42.1 39.92,42.09
  Bottom Layer w0.2: v2(42.67,42.33) 28.32,42.33 11.85,25.86 11.85,21.51 12.48,20.88 RN9.5
HEX_2_G: length 46.7
  Top Layer w0.201: 39.92,41.59 39.93,41.58 40.73,41.58 40.77,41.62 41.73,41.62 41.9,41.8 v2(43.13,41.8)
  Bottom Layer w0.2: RN9.6 13.28,20.96 12.48,21.76 12.48,25.65 28.62,41.8 v2(43.13,41.8)
HEX_3_A: length 48.4
  Top Layer w0.2: 42.64,44.91 41.82,44.91 41.64,45.09 39.92,45.09
  Bottom Layer w0.2: RN10.8 10.62,20.88 11.25,21.51 11.25,26.11 30.05,44.91 42.64,44.91
  vias: v2(42.63,44.91)
HEX_3_B: length 50.5
  Top Layer w0.201: 43.18,45.49 41.71,45.49 41.58,45.62 40.67,45.62 40.64,45.59 39.92,45.59
  Bottom Layer w0.2: RN10.7 9.82,20.93 10.65,21.76 10.65,26.36 29.78,45.49 43.18,45.49
  vias: v2(43.15,45.49)
HEX_3_C: length 50.4
  Top Layer w0.201: 42.6,46.04 41.63,46.04 41.59,46.09 39.92,46.09
  Bottom Layer w0.2: RN10.6 9.02,20.98 10.05,22.01 10.05,26.61 29.49,46.04 42.6,46.04
  vias: v2(42.63,46.04)
HEX_3_D: length 53
  Top Layer w0.201: 42.67,47.15 42.64,47.12 40.43,47.12 40.36,47.06 39.95,47.06 39.92,47.09
  Bottom Layer w0.2: 42.67,47.15 29.03,47.15 8.85,26.97 8.85,23.37 6.35,20.88 RN11.8
  vias: v2(42.63,47.15)
HEX_3_DP: length 52.3
  Top Layer w0.201: 39.92,46.59 41.59,46.59 41.6,46.6 43.13,46.6
  Bottom Layer w0.2: 43.13,46.6 29.38,46.6 9.46,26.67 9.46,22.08 8.23,20.84 8.23,19.98 RN10.5
  vias: v2(43.15,46.6)
HEX_3_E: length 54.9
  Top Layer w0.201: 39.92,47.59 41.49,47.59 41.6,47.69 43.13,47.69
  Bottom Layer w0.2: RN11.7 5.55,20.93 8.25,23.62 8.25,27.16 28.78,47.69 43.13,47.69
  vias: v2(43.15,47.69)
HEX_3_F: length 56.7
  Top Layer w0.201: v2(42.64,50.11) 39.95,50.11 39.93,50.09
  Bottom Layer w0.2: v2(42.64,50.11) 29.31,50.11 7.05,27.85 7.05,24.12 3.95,21.03 3.95,19.97
HEX_3_G: length 56.6
  Top Layer w0.19: v2(43.15,49.59) 43.15,49.59 U1.7
  Bottom Layer w0.2: v2(43.15,49.59) 42.86,49.59 ; 42.85,49.58 42.42,49.58 42.41,49.6 29.73,49.6 7.68,27.54 7.68,23.85 4.78,20.96 4.78,20 4.75,19.97
KEY0: length 40.8
  Top Layer w0.254: v1(90.56,26.66) 91.81,26.66 KEY0.2 ; 79.25,32.25 78.59,32.25 78.29,31.95 78.29,29.49 ; 79.25,32.25 79.25,32.83 69.49,42.59 U1.88 ; 79.25,32.25 R31.1
  Bottom Layer w0.254: v1(90.56,26.66) 80.96,26.66 78.29,29.33 78.29,29.49
  vias: v1(78.29,29.51)
KEY1: length 31.9
  Top Layer w0.254: U1.87 69.14,42.09 77.13,34.1 R10.1 77.09,32.12 76.25,32.12 76.07,31.94 76.07,29.21 77.09,28.19 80.59,28.19 KEY1.2
KEY2: length 26.4
  Top Layer w0.254: 72.22,26.41 73.85,28.04 73.85,32.01 74.1,32.26 R29.1 74.98,35.39 68.76,41.61 61.85,41.61 U1.86
KEY3: length 29.4
  Top Layer w0.254: U1.85 61.86,41.06 68.4,41.06 72.8,36.66 R28.1 68.84,32.26 KEY3.2
LED0: length 10.6
  Top Layer w0.2: 59.62,28.05 59.62,32.89
  Top Layer w0.201: 59.62,28.05 59.62,23.37 59.11,22.86 LED0.1
LED1: length 14.7
  Top Layer w0.2: 59.12,28.05 59.12,32.89
  Top Layer w0.201: 59.12,28.05 59.12,25.43 57.39,23.69 54.28,23.69 53.12,22.53 LED1.1
LED2: length 20
  Top Layer w0.2: 58.62,28.05 58.62,32.89
  Top Layer w0.201: 58.62,28.05 58.62,25.77 57.06,24.2 48.74,24.2 LED2.1
LED3: length 25.3
  Top Layer w0.2: 58.12,32.89 58.12,28.05
  Top Layer w0.201: LED3.1 43.23,24.71 56.65,24.71 58.12,26.18 58.12,28.05
LED4: length 30.6
  Top Layer w0.2: 57.62,32.89 57.62,28.05
  Top Layer w0.201: 57.62,28.05 57.62,26.54 56.3,25.22 37.71,25.22 LED4.1
LED5: length 35.9
  Top Layer w0.2: 57.12,28.05 57.12,32.89
  Top Layer w0.201: LED5.1 29.24,22.53 32.43,25.72 55.97,25.72 57.12,26.88 57.12,28.05
LED6: length 41.3
  Top Layer w0.201: LED6.1 26.69,26.23 55.66,26.23 56.62,27.2 56.62,32.89
LED7: length 45.2
  Top Layer w0.2: 55.12,31.07 55.12,32.89
  Top Layer w0.201: 55.12,31.07 55,30.94 55,27.99 53.75,26.74 21.18,26.74 LED7.1
LED8: length 50.6
  Top Layer w0.201: 54.62,32.89 54.62,28.39 53.49,27.25 15.67,27.25 LED8.1
LED9: length 56
  Top Layer w0.201: 54.12,32.89 54.12,28.6 53.29,27.76 10.16,27.76 LED9.1
P1_IO1: length 27.6
  Top Layer w0.2: v2(59.31,52.56) 59.34,52.59 61.82,52.59
  Bottom Layer w0.2: v2(59.31,52.56) 59.32,52.57 72.87,52.57 80.06,59.77 RN13.8
P1_IO2: length 29.2
  Top Layer w0.2: 61.82,52.09 60.13,52.09 60.08,52.03 58.6,52.03 v2(58.5,52.13)
  Bottom Layer w0.2: RN13.7 80.07,58.97 73.14,52.03 58.6,52.03 v2(58.5,52.13)
P1_IO3: length 27.5
  Top Layer w0.2: 61.82,51.59 60.03,51.59 59.95,51.51 v2(59.28,51.51)
  Bottom Layer w0.2: RN13.6 80.1,58.17 73.43,51.51 v2(59.28,51.51)
P1_IO4: length 29
  Top Layer w0.2: 61.82,51.09 61.78,51.13 60.18,51.13 59.95,50.9 v2(58.51,50.9)
  Bottom Layer w0.2: v2(58.51,50.9) 73.62,50.9 80.1,57.37 RN13.5
P1_IO5: length 26.4
  Top Layer w0.201: v2(59.3,50.35) 59.84,50.35 60.08,50.59 61.82,50.59
  Bottom Layer w0.2: v2(59.3,50.35) 74.04,50.35 77.88,54.18 RN12.8
P1_IO6: length 27.8
  Top Layer w0.201: 61.82,50.09 60.1,50.09 59.83,49.82 v2(58.5,49.82)
  Bottom Layer w0.2: v2(58.5,49.82) 74.42,49.82 77.99,53.38 RN12.7
P1_IO7: length 26.2
  Top Layer w0.201: 61.82,49.59 60.09,49.59 59.8,49.29 v2(59.31,49.29)
  Bottom Layer w0.2: RN12.6 77.94,52.58 74.54,49.18 59.42,49.18 v2(59.31,49.29)
P1_IO8: length 27.8
  Top Layer w0.201: 61.82,49.09 60.31,49.09 59.97,48.74 58.7,48.74 v2(58.52,48.92)
  Bottom Layer w0.2: RN12.5 77.89,51.78 74.83,48.72 58.87,48.72 58.67,48.92 v2(58.52,48.92)
P2_IO1: length 27
  Top Layer w0.201: v2(59.1,47.62) 59.12,47.59 61.82,47.59
  Bottom Layer w0.2: RN15.8 79.03,42.88 74.29,47.62 v2(59.1,47.62)
P2_IO2: length 28.5
  Top Layer w0.201: v2(58.42,46.9) 59.93,46.9 60.11,47.09 61.82,47.09
  Bottom Layer w0.2: v2(58.42,46.9) 74.1,46.9 78.92,42.08 RN15.7
P2_IO3: length 27.2
  Top Layer w0.201: 61.82,46.59 60.11,46.59 59.8,46.27 v2(59.12,46.27)
  Bottom Layer w0.2: RN15.6 78.51,41.28 73.51,46.27 v2(59.12,46.27)
P2_IO4: length 28.7
  Top Layer w0.201: 61.82,46.09 60.19,46.09 59.85,45.75 v2(58.45,45.75)
  Bottom Layer w0.2: v2(58.45,45.75) 72.98,45.75 78.25,40.48 RN15.5
P2_IO5: length 28.4
  Top Layer w0.201: v2(59.08,45.2) 59.2,45.09 59.68,45.09 60.17,45.59 61.82,45.59
  Bottom Layer w0.2: v2(59.08,45.2) 72.42,45.2 79.83,37.8 RN14.8
P2_IO6: length 29.7
  Top Layer w0.201: 61.82,45.09 60.32,45.09 59.91,44.68 v2(58.45,44.68)
  Bottom Layer w0.2: v2(58.45,44.68) 71.89,44.68 79.57,37 RN14.7
P2_IO7: length 28.4
  Top Layer w0.2: 61.82,44.09 59.11,44.09 v2(59.06,44.14)
  Bottom Layer w0.2: RN14.6 79.4,36.2 71.46,44.14 v2(59.06,44.14)
P2_IO8: length 28.5
  Top Layer w0.201: v2(59.06,42.95) 59.19,43.09 61.82,43.09
  Bottom Layer w0.2: RN14.5 79.22,35.4 71.51,43.11 59.22,43.11 v2(59.06,42.95)
PIN_109: length 11.1
  Top Layer w0.2: U1.109 59.63,53.89 60.31,53.21 67.29,53.21 R27.2
PIN_110: length 20.1
  Top Layer w0.201: 59.12,54.79 59.12,56.81 61.53,59.21 68.02,59.21 72.97,64.17 H2.33
PIN_111: length 22.3
  Top Layer w0.201: 58.62,54.79 58.62,57.25 61.07,59.69 66.75,59.69 71.71,64.65 71.71,66.24 72.97,67.5 H2.34
PIN_112: length 18.6
  Top Layer w0.201: H2.31 70.43,64.86 65.76,60.18 60.61,60.18 58.12,57.7 58.12,54.79
PIN_113: length 21.4
  Top Layer w0.201: 57.62,54.79 57.62,58.19 60.1,60.66 65.27,60.66 69.18,64.57 69.18,66.59 H2.32
PIN_114: length 17.4
  Top Layer w0.201: H2.29 63.74,61.15 59.66,61.15 57.12,58.62 57.12,54.79
PIN_117: length 22.8
  Top Layer w0.201: v2(55.62,52.46) 55.62,52.47 55.62,54.79
  Bottom Layer w0.201: H2.30 66.55,66.5 66.55,63.39 v2(55.62,52.46)
PIN_118: length 17.4
  Top Layer w0.201: 55.12,54.79 55.12,58.92 57.86,61.65 62.31,61.65 65.35,64.69 H2.27
PIN_119: length 19.8
  Top Layer w0.201: H2.28 64.09,66.58 64.09,64.66 61.56,62.13 57.65,62.13 54.62,59.11 54.62,54.79
PIN_120: length 16.1
  Top Layer w0.201: H2.25 62.81,64.64 60.76,62.6 57.45,62.6 54.12,59.27 54.12,54.79
PIN_121: length 18.4
  Top Layer w0.201: 53.62,54.79 53.62,59.46 57.34,63.18 60.03,63.18 61.51,64.65 61.51,66.54 H2.26
PIN_122: length 14.7
  Top Layer w0.201: 53.12,54.79 53.12,59.57 57.21,63.65 59.3,63.65 60.27,64.62 H2.23
PIN_123: length 17.2
  Top Layer w0.201: H2.24 59.94,67.84 59,66.9 59,64.75 58.37,64.13 57,64.13 52.62,59.75 52.62,54.79
PIN_124: length 13
  Top Layer w0.201: 52.12,54.79 52.16,54.82 52.16,60.03 57.43,65.3 H2.21
PIN_125: length 20.2
  Top Layer w0.201: v2(51.87,52.47) 51.87,53.18 51.62,53.42 51.62,54.79
  Bottom Layer w0.201: H2.22 56.48,66.59 56.48,64.7 51.87,60.09 v2(51.87,52.47)
PIN_127: length 17.3
  Top Layer w0.201: v2(50.36,52.47) 50.36,53.17 50.62,53.43 50.62,54.79
  Bottom Layer w0.201: v2(50.36,52.47) 50.36,60.47 H2.19
PIN_129: length 15.4
  Top Layer w0.2: 49.62,54.79 49.62,59.66 53.98,64.01 53.98,66.63 H2.20
PIN_130: length 12
  Top Layer w0.2: 49.12,54.79 49.12,60.5 52.65,64.03 H2.17
PIN_131: length 14.7
  Top Layer w0.2: H2.18 51.35,66.54 51.35,64.09 48.62,61.37 48.62,54.79
PIN_132: length 11.3
  Top Layer w0.2: 48.12,54.79 48.12,62.08 50.1,64.05 50.1,65.29
  Top Layer w0.254: 50.1,65.29 H2.15
PIN_133: length 14.1
  Top Layer w0.2: H2.16 48.8,66.53 48.8,64.06 47.62,62.89 47.62,54.79
PIN_134: length 10.7
  Top Layer w0.2: H2.13 47.17,64.9 47.17,54.84
  Top Layer w0.254: 47.12,54.79 47.17,54.84
PIN_138: length 14.1
  Top Layer w0.2: 45.12,54.79 45.12,62.94 46.22,64.03 46.22,66.49 H2.14
PIN_139: length 10.7
  Top Layer w0.2: 44.62,54.79 44.62,63.62 45.03,64.03 H2.11
PIN_140: length 13.7
  Top Layer w0.2: H2.12 43.77,66.58 43.77,64 44.12,63.64 44.12,54.79
PIN_141: length 11.1
  Top Layer w0.2: 42.36,65.17 42.56,64.97 42.56,64 43.62,62.93 43.62,54.79
  Top Layer w0.254: 42.36,65.17 H2.9
PIN_142: length 14.4
  Top Layer w0.2: 43.12,54.79 43.12,62.11 41.2,64.04 41.2,66.55 H2.10
PIN_143: length 11.6
  Top Layer w0.2: 40,65.26 40,64.05 42.62,61.42 42.62,54.79
  Top Layer w0.254: 40,65.26 H2.7
PIN_144: length 15
  Top Layer w0.2: H2.8 38.7,66.59 38.7,64.16 42.12,60.73 42.12,54.79
SW0: length 31.3
  Top Layer w0.201: 61.82,40.59 60.31,40.59 60.17,40.73 v2(58.47,40.73)
  Bottom Layer w0.2: RN1.8 72.27,33.39 64.93,40.73 v2(58.47,40.73)
SW1: length 30.1
  Top Layer w0.201: v2(58.48,39.29) 58.65,39.29 58.83,39.47 60.09,39.47 60.47,39.09 61.82,39.09
  Bottom Layer w0.2: v2(58.48,39.29) 58.68,39.49 65.17,39.49 71.47,33.19 RN1.7
SW2: length 27.5
  Top Layer w0.201: 61.82,38.59 60.35,38.59 60.1,38.84 v2(59.08,38.84)
  Bottom Layer w0.2: v2(59.08,38.84) 64.69,38.84 70.67,32.86 RN1.6
SW3: length 27.5
  Top Layer w0.201: v2(58.47,38.22) 60.16,38.22 60.3,38.09 61.82,38.09
  Bottom Layer w0.2: v2(58.47,38.22) 58.5,38.25 64.23,38.25 69.9,32.59 69.9,22.35 RN1.5
SW4: length 24.1
  Top Layer w0.201: 61.82,37.59 60.24,37.59 60.14,37.69 v2(59.09,37.69)
  Bottom Layer w0.2: v2(59.09,37.69) 63.55,37.69 67.06,34.18 RN2.8
SW5: length 24
  Top Layer w0.201: v2(58.48,37.08) 58.48,37.09 61.82,37.09
  Bottom Layer w0.2: 66.26,22.32 66.26,33.85 62.97,37.14 58.53,37.14 v2(58.48,37.08)
SW6: length 21.6
  Top Layer w0.201: 61.82,36.59 59.32,36.59 59.29,36.56 v2(59.09,36.56)
  Bottom Layer w0.2: v2(59.09,36.56) 62.42,36.56 65.46,33.52 RN2.6
SW7: length 21.6
  Top Layer w0.201: v2(58.49,36.01) 60.02,36.01 60.1,36.09 61.82,36.09
  Bottom Layer w0.2: 64.66,22.32 64.66,33.19 61.84,36.01 v2(58.49,36.01)
SW8: length 17.9
  Top Layer w0.201: 61.82,35.59 60.21,35.59 60.02,35.39 v2(59.08,35.39)
  Bottom Layer w0.201: v2(59.08,35.39) 60.46,35.39 61.85,33.99 RN3.8
SW9: length 13.8
  Top Layer w0.254: v2(60.46,34.05) 60.78,34.05 61.82,35.09
  Bottom Layer w0.201: RN3.7 61.05,33.45 v2(60.46,34.05)
TCK: length 51.4
  Top Layer w0.2: v2(48.74,48.87) 48.74,41.46 42.88,35.59 U1.35
  Bottom Layer w0.201: H1.1 26.48,62.46 35.15,62.46 v2(48.74,48.87)
TDI: length 60.7
  Top Layer w0.201: v2(48.2,46.65) 48.2,41.55 42.75,36.09 U1.34
  Bottom Layer w0.201: H1.9 14.03,64.74 14.03,61.76 15.63,60.17 34.23,60.17 47.75,46.65 v2(48.2,46.65)
TDO: length 56
  Top Layer w0.201: U1.36 42.94,35.09 49.29,41.44 v2(49.29,47.7)
  Bottom Layer w0.201: v2(49.29,47.7) 48.84,47.7 34.85,61.69 22.57,61.69 21.78,62.48 21.78,64.91 20.81,65.88 H1.3
TMS: length 55.1
  Top Layer w0.201: 47.67,47.92 47.67,41.59 42.67,36.59 U1.33
  Bottom Layer w0.201: v2(47.67,47.74) 34.47,60.94 19.98,60.94 19.19,61.73 19.19,64.67 H1.5
$1N1578: length 12.8
  Bottom Layer w0.254: 66.26,20.72 66.26,11.41 SW5.2
$1N1579: length 16.8
  Bottom Layer w0.254: RN2.3 65.46,17.42 64.66,16.62 61.72,16.62 60.65,15.55 60.65,12.13 SW6.2
$1N1580: length 26.1
  Bottom Layer w0.254: RN1.2 71.47,19.06 72.58,17.95 84.54,17.95 85.71,16.78 85.71,12.33 SW1.2
$1N1581: length 20.3
  Bottom Layer w0.254: RN1.3 70.67,18.57 71.88,17.36 77.79,17.36 79.29,15.86 79.29,12.41 SW2.2
$1N1582: length 15.1
  Bottom Layer w0.254: RN1.4 69.87,18.05 71.26,16.66 72.31,16.66 73.24,15.73 73.24,12.13 SW3.2
$1N1583: length 13.1
  Bottom Layer w0.254: RN2.1 67.06,11.97 SW4.2
$1N1602: length 30.7
  Bottom Layer w0.254: SW0.2 92.24,12.14 92.24,15.62 89.33,18.53 73.41,18.53 72.3,19.64 72.3,20.69 RN1.1
$1N5270: length 4.1
  Top Layer w0.254: 39.64,18.52 39.64,22.25 LED3.2
$1N5271: length 4.1
  Top Layer w0.254: LED2.2 45.67,22.24 R2.2
$1N5272: length 4.1
  Top Layer w0.254: R5.2 27.56,22.28 LED5.2
$1N5273: length 4.1
  Top Layer w0.254: R4.2 33.6,22.27 LED4.2
$1N5274: length 4.1
  Top Layer w0.254: R7.2 15.49,22.31 LED7.2
$1N5275: length 4.1
  Top Layer w0.254: LED1.2 51.71,22.22 R1.2
$1N5276: length 4.1
  Top Layer w0.254: LED6.2 21.53,22.3 R6.2
$1N5281: length 4.1
  Top Layer w0.254: LED0.2 57.61,22.33 R0.2
$1N5960: length 4.1
  Top Layer w0.254: R9.2 3.42,22.34 LED9.2
$1N5966: length 4.1
  Top Layer w0.254: LED8.2 9.46,22.33 R8.2
$1N21558: length 21.8
  Bottom Layer w0.254: SW7.2 54.2,12.02 54.2,14.82 56.62,17.24 64.15,17.24 64.66,17.75 64.66,20.72
$1N21605: length 25.1
  Bottom Layer w0.254: RN3.1 61.85,18.72 61.04,17.9 50.33,17.9 47.89,15.46 47.89,12.04 SW8.2
$1N21745: length 31.4
  Bottom Layer w0.254: SW9.2 41.41,11.9 41.41,16.94 43.2,18.73 60.65,18.73 61.05,19.14 RN3.2
$1N29238: length 9.8
  Top Layer w0.254: U6.A5 8.34,53.23 11.12,50.44 13.91,50.44 R20.2
$1N29243: length 6.4
  Top Layer w0.254: U6.B5 8.29,52.23 11.1,49.42 R21.2
$1N32570: length 2.8
  Top Layer w0.254: R22.2 12.18,53.23 LED10.2
$1N67022: length 5.8
  Top Layer w0.254: R27.1 70.42,54.74 68.56,56.6
$1N67183: length 8.1
  Top Layer w0.5: Q1.3 71.91,55.65 73.16,54.4 BUZZER1.2 73.16,48.94 D2.2
$1N75208: length 5.7
  Bottom Layer w0.2: RN4.1 36.23,18.34 36.23,17.3 33.6,14.67 33.6,13.74
$1N75216: length 8.8
  Bottom Layer w0.2: RN4.2 35.4,17.32 32.53,14.45 32.53,12.27 33.6,11.2
$1N75222: length 11.4
  Bottom Layer w0.201: HEX0.8 32.03,10.23 32.03,14.85 34.6,17.41 RN4.3
$1N75228: length 14
  Bottom Layer w0.201: RN4.4 33.8,17.48 31.54,15.22 31.54,8.18 HEX0.7
$1N75251: length 7.6
  Bottom Layer w0.2: RN5.4 29.56,18.34 29.56,12.24 28.52,11.2
$1N75256: length 10.5
  Bottom Layer w0.2: RN5.3 30.33,16.64 30.06,16.36 30.06,10.19 28.52,8.66
$1N75262: length 13.3
  Bottom Layer w0.201: 28.52,6.12 30.55,8.15 30.55,16.04 31.13,16.63 RN5.2
$1N75268: length 16.2
  Bottom Layer w0.201: RN5.1 31.93,16.53 31.04,15.64 31.04,6.1 28.52,3.58
$1N75461: length 13.2
  Bottom Layer w0.201: 22.35,8.22 20.35,6.22 HEX1.4 ; 22.37,8.22 22.37,15.77 22.61,16.01 RN7.2
$1N75464: length 10.4
  Bottom Layer w0.201: 21.9,18.28 21.81,18.37 ; 21.86,18.28 21.86,10.17 HEX1.3
$1N75467: length 7.7
  Bottom Layer w0.201: 20.35,11.2 21.36,12.21 21.36,14.57 21.01,14.93 RN7.4
$1N75470: length 16.1
  Bottom Layer w0.201: 20.35,3.58 22.87,6.09 22.87,15.54 23.44,16.11 23.44,18.34 23.41,18.37
$1N75474: length 5.6
  Bottom Layer w0.201: 25.43,13.74 27.67,15.98 27.67,18.37
$1N75477: length 8.7
  Bottom Layer w0.201: 25.43,11.2 24.37,12.26 24.37,14.36 26.87,16.86 26.87,18.37
$1N75480: length 11.3
  Bottom Layer w0.201: RN6.3 26.07,16.89 23.87,14.68 23.87,10.24 23.86,10.23 HEX1.8
$1N75483: length 13.9
  Bottom Layer w0.201: RN6.4 25.27,17.02 23.37,15.11 23.37,8.18 HEX1.7
$1N75690: length 13.1
  Bottom Layer w0.201: 14.21,18.37 14.21,8.14 HEX2.4
$1N75693: length 10.5
  Bottom Layer w0.201: HEX2.3 13.72,10.2 13.72,14.97 13.28,15.42 RN9.3
$1N75696: length 8.2
  Bottom Layer w0.201: 12.18,11.2 12.58,11.2 13.24,11.86 13.24,14.57 12.48,15.33 RN9.4
$1N75699: length 15.9
  Bottom Layer w0.201: 12.18,3.58 14.71,6.1 ; 14.69,6.1 14.69,15.43 14.71,15.43 14.88,15.6 RN9.1
$1N75703: length 5.4
  Bottom Layer w0.201: RN8.1 19.1,18.32 19.1,16 17.26,14.16 17.26,13.74
$1N75706: length 8.5
  Bottom Layer w0.201: 17.26,11.2 16.15,12.31 16.15,14.38 18.34,16.58 RN8.2
$1N75709: length 11.2
  Bottom Layer w0.201: RN8.3 17.51,18.33 17.51,16.49 15.66,14.64 15.66,10.25 ; HEX2.8 15.67,10.25
$1N75712: length 13.8
  Bottom Layer w0.201: HEX2.7 15.18,8.2 15.18,14.97 16.73,16.52 16.73,18.35 RN8.4
$1N75919: length 13.7
  Bottom Layer w0.201: HEX3.4 4.67,6.12 6.02,7.47 6.02,15.29 5.55,15.76 RN11.2
$1N75922: length 10.9
  Bottom Layer w0.201: HEX3.3 4.44,8.66 5.52,9.75 5.52,14.85 4.75,15.62 4.75,18.37
$1N75925: length 8.4
  Bottom Layer w0.201: 4.01,11.2 4.66,11.2 5.02,11.57 5.02,14.39 3.95,15.46 3.95,18.37
$1N75928: length 15.9
  Bottom Layer w0.201: RN11.1 6.35,15.62 6.52,15.46 6.52,6.09 4.01,3.58
$1N75932: length 5.3
  Bottom Layer w0.201: 9.09,13.74 10.62,15.27 RN10.1
$1N75935: length 8.4
  Bottom Layer w0.201: 9.09,11.2 8.02,12.27 8.02,14.25 9.82,16.05 RN10.2
$1N75938: length 11
  Bottom Layer w0.201: RN10.3 9.02,16.17 7.52,14.67 7.52,10.23 HEX3.8
$1N75941: length 13.6
  Bottom Layer w0.201: RN10.4 8.22,16.24 7.02,15.04 7.02,8.19 HEX3.7
$1N98164: length 8
  Bottom Layer w0.201: RN14.2 83.73,37 85.93,39.19 88.27,39.19 89.5,40.42 H4.6
$1N98167: length 5.1
  Bottom Layer w0.201: H4.1 85.67,45.5 RN15.1
$1N98168: length 7.6
  Bottom Layer w0.201: H4.4 88.45,41.78 85.98,41.78 84.68,40.48 RN15.4
$1N98171: length 8
  Bottom Layer w0.201: RN12.2 83.85,53.38 86,55.53 88.37,55.53 H3.6
$1N98172: length 5.1
  Bottom Layer w0.201: RN12.1 83.35,54.18 85.96,56.79 H3.5
$1N98173: length 4.7
  Bottom Layer w0.201: H3.7 85.91,54.25 84.24,52.58 RN12.3
$1N98174: length 4.5
  Bottom Layer w0.201: H3.3 85.98,59.33 84.82,58.17 RN13.3
$1N98175: length 4.9
  Bottom Layer w0.201: H3.1 85.14,61.87 RN13.1
$1N98177: length 7.4
  Bottom Layer w0.201: RN13.4 83.06,57.35 85.29,57.35 86.01,58.07 88.37,58.07 ; H3.4 88.37,58.07
$1N98179: length 7.7
  Bottom Layer w0.201: RN12.4 84.56,51.78 85.8,53.02 88.51,53.02 89.63,54.14 H3.8
$1N98180: length 7.8
  Bottom Layer w0.201: RN13.2 84.19,58.97 85.7,60.48 88.24,60.48 H3.2
$1N98181: length 8
  Bottom Layer w0.201: RN15.2 83.44,42.08 85.61,44.25 88.38,44.25 H4.2
$1N98182: length 7.6
  Bottom Layer w0.201: RN14.4 84.81,35.4 85.99,36.57 88.32,36.57 H4.8
$1N98183: length 4.7
  Bottom Layer w0.201: RN14.3 84.15,36.2 85.83,37.88 H4.7
$1N98184: length 4.7
  Bottom Layer w0.201: H4.3 85.77,42.96 84.09,41.28 RN15.3
$1N98185: length 5.1
  Bottom Layer w0.201: H4.5 86.13,40.42 83.5,37.8 RN14.1

## Copper pours and planes (outline as drawn; the poured copper is in the pictures)
1.8V on Inner2: 44.71,37.91 44.71,42.53 31.06,42.53 30.84,42.62 30.76,42.83 30.76,43.95 30.84,44.16 31.06,44.25 44.71,44.25 44.71,49.87 56.72,49.87 56.72,37.91
3.3V on Top Layer: 29.52,48.21 29.53,48.39 29.59,48.58 29.68,48.76 29.81,48.92 29.97,49.04 30.15,49.14 30.34,49.19 30.52,49.21 32.35,49.21 32.52,49.19 32.72,49.14 32.9,49.04 33.05,48.92 33.18,48.76 33.27,48.58 33.33,48.39 33.35,48.21 33.35,49.27 33.33,49.09 33.27,48.9 33.18,48.72 33.05,48.56 32.9,48.44 32.72,48.34 32.52,48.29 32.35,48.27 30.52,48.27 30.34,48.29 30.15,48.34 29.97,48.44 29.81,48.56 29.68,48.72 29.59,48.9 29.53,49.09 29.52,49.27
3.3V on Top Layer: 17.78,46.64 23.25,46.64 23.25,43.72 17.78,43.72
3.3V on Inner2: -0.26,70 99.95,70 99.95,-0.16 -0.26,-0.16
GND on Top Layer: 0.95,67 0.97,67.28 1.03,67.56 1.13,67.83 1.26,68.08 1.43,68.31 1.64,68.51 1.86,68.68 2.12,68.82 2.38,68.92 2.66,68.98 2.95,69 96.95,69 97.23,68.98 97.51,68.92 97.78,68.82 98.03,68.68 98.26,68.51 98.46,68.31 98.63,68.08 98.77,67.83 98.86,67.56 98.93,67.28 98.95,67 98.95,3 98.93,2.72 98.86,2.44 98.77,2.17 98.63,1.92 98.46,1.69 98.26,1.49 98.03,1.32 97.78,1.18 97.51,1.08 97.23,1.02 96.95,1 2.95,1 2.66,1.02 2.38,1.08 2.12,1.18 1.86,1.32 1.64,1.49 1.43,1.69 1.26,1.92 1.13,2.17 1.03,2.44 0.97,2.72 0.95,3
GND on Bottom Layer: 0.95,67 0.97,67.28 1.03,67.56 1.13,67.83 1.26,68.08 1.43,68.31 1.64,68.51 1.86,68.68 2.12,68.82 2.38,68.92 2.66,68.98 2.95,69 96.95,69 97.23,68.98 97.51,68.92 97.78,68.82 98.03,68.68 98.26,68.51 98.46,68.31 98.63,68.08 98.77,67.83 98.86,67.56 98.93,67.28 98.95,67 98.95,3 98.93,2.72 98.86,2.44 98.77,2.17 98.63,1.92 98.46,1.69 98.26,1.49 98.03,1.32 97.78,1.18 97.51,1.08 97.23,1.02 96.95,1 2.95,1 2.66,1.02 2.38,1.08 2.12,1.18 1.86,1.32 1.64,1.49 1.43,1.69 1.26,1.92 1.13,2.17 1.03,2.44 0.97,2.72 0.95,3
GND on Inner1: 0.25,69.74 99.69,69.74 99.69,0.26 0.25,0.26

Small or netless copper shapes (teardrops, artwork), in the pictures only: 1 on Top Layer

## Text on the board
Bottom Silkscreen Layer: Nayarit | DISEÑADA Y / ENSAMBLADA EN
Top Silkscreen Layer: off | on | LOGIC LAB / BY POCKET LABS
